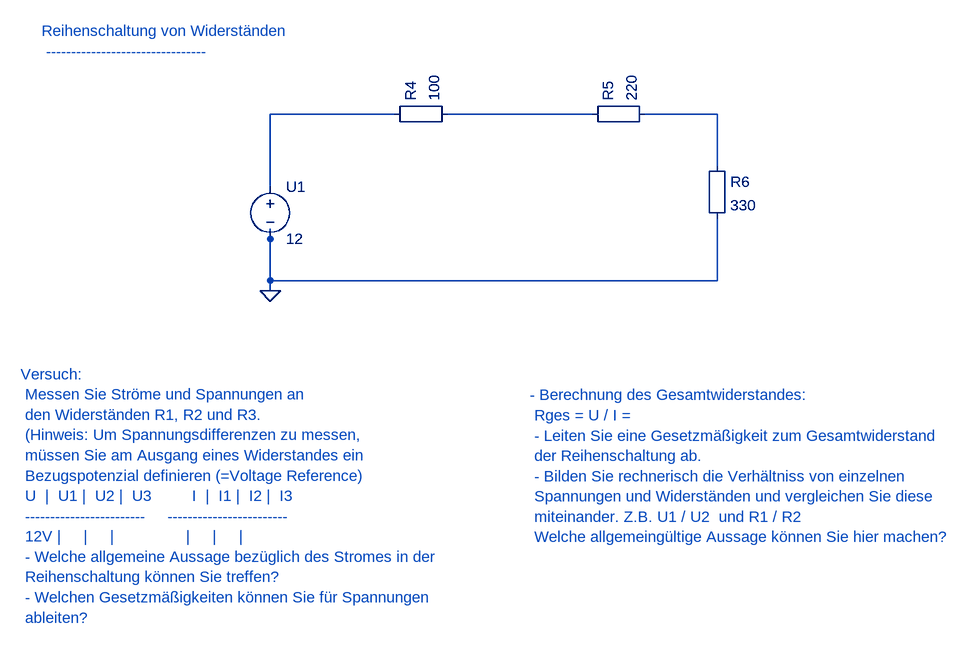
[diagram p0: schematic 1_1_2_Reihenschaltung.asc]
1_1_2_Reihenschaltung.asc, the LTspice schematic file:
Version 4
SHEET 1 880 680
WIRE 416 384 416 368
WIRE 416 464 416 448
WIRE 608 192 416 192
WIRE 416 192 416 304
WIRE 688 192 912 192
WIRE 992 192 1104 192
WIRE 1104 192 1104 272
WIRE 416 448 416 368
WIRE 1104 352 1104 448
WIRE 1104 448 416 448
FLAG 416 464 0
SYMBOL voltage 416 288 R0
SYMATTR InstName U1
SYMATTR Value 12
SYMBOL Misc\EuropeanResistor 592 208 R270
SYMATTR InstName R4
SYMATTR Value 100
SYMBOL Misc\EuropeanResistor 896 208 R270
SYMATTR InstName R5
SYMATTR Value 220
SYMBOL Misc\EuropeanResistor 1088 256 R0
SYMATTR InstName R6
SYMATTR Value 330
TEXT 64 64 Left 2 ;Reihenschaltung von Widerständen \n --------------------------------
TEXT 32 592 Left 2 ;Versuch: \n Messen Sie Ströme und Spannungen an \n den Widerständen R1, R2 und R3. \n (Hinweis: Um Spannungsdifferenzen zu messen, \n müssen Sie am Ausgang eines Widerstandes ein \n Bezugspotenzial definieren (=Voltage Reference) \n U  |  U1 |  U2 |  U3         I  |  I1 |  I2 |  I3 \n ------------------------     ------------------------ \n 12V |     |     |                |     |     | \n - Welche allgemeine Aussage bezüglich des Stromes in der \n Reihenschaltung können Sie treffen? \n - Welchen Gesetzmäßigkeiten können Sie für Spannungen \n ableiten?
TEXT 816 624 Left 2 ;- Berechnung des Gesamtwiderstandes: \n Rges = U / I = \n - Leiten Sie eine Gesetzmäßigkeit zum Gesamtwiderstand \n der Reihenschaltung ab. \n - Bilden Sie rechnerisch die Verhältniss von einzelnen \n Spannungen und Widerständen und vergleichen Sie diese \n miteinander. Z.B. U1 / U2  und R1 / R2 \n Welche allgemeingültige Aussage können Sie hier machen?

The netlist it stands for:
* 1_1_2_Reihenschaltung.asc
V§U1 N001 0 12
R4 N001 N002 100
R5 N002 N003 220
R6 N003 0 330
* Reihenschaltung von Widerständen
*  --------------------------------
* Versuch:
*  Messen Sie Ströme und Spannungen an
*  den Widerständen R1, R2 und R3.
*  (Hinweis: Um Spannungsdifferenzen zu messen,
*  müssen Sie am Ausgang eines Widerstandes ein
*  Bezugspotenzial definieren (=Voltage Reference)
*  U  |  U1 |  U2 |  U3         I  |  I1 |  I2 |  I3
*  ------------------------     ------------------------
*  12V |     |     |                |     |     |
*  - Welche allgemeine Aussage bezüglich des Stromes in der
*  Reihenschaltung können Sie treffen?
*  - Welchen Gesetzmäßigkeiten können Sie für Spannungen
*  ableiten?
* - Berechnung des Gesamtwiderstandes:
*  Rges = U / I =
*  - Leiten Sie eine Gesetzmäßigkeit zum Gesamtwiderstand
*  der Reihenschaltung ab.
*  - Bilden Sie rechnerisch die Verhältniss von einzelnen
*  Spannungen und Widerständen und vergleichen Sie diese
*  miteinander. Z.B. U1 / U2  und R1 / R2
*  Welche allgemeingültige Aussage können Sie hier machen?
.backanno
.end